# EAGLE schematic AttenuvertingVCA_Test (EAGLE 8.0.0)
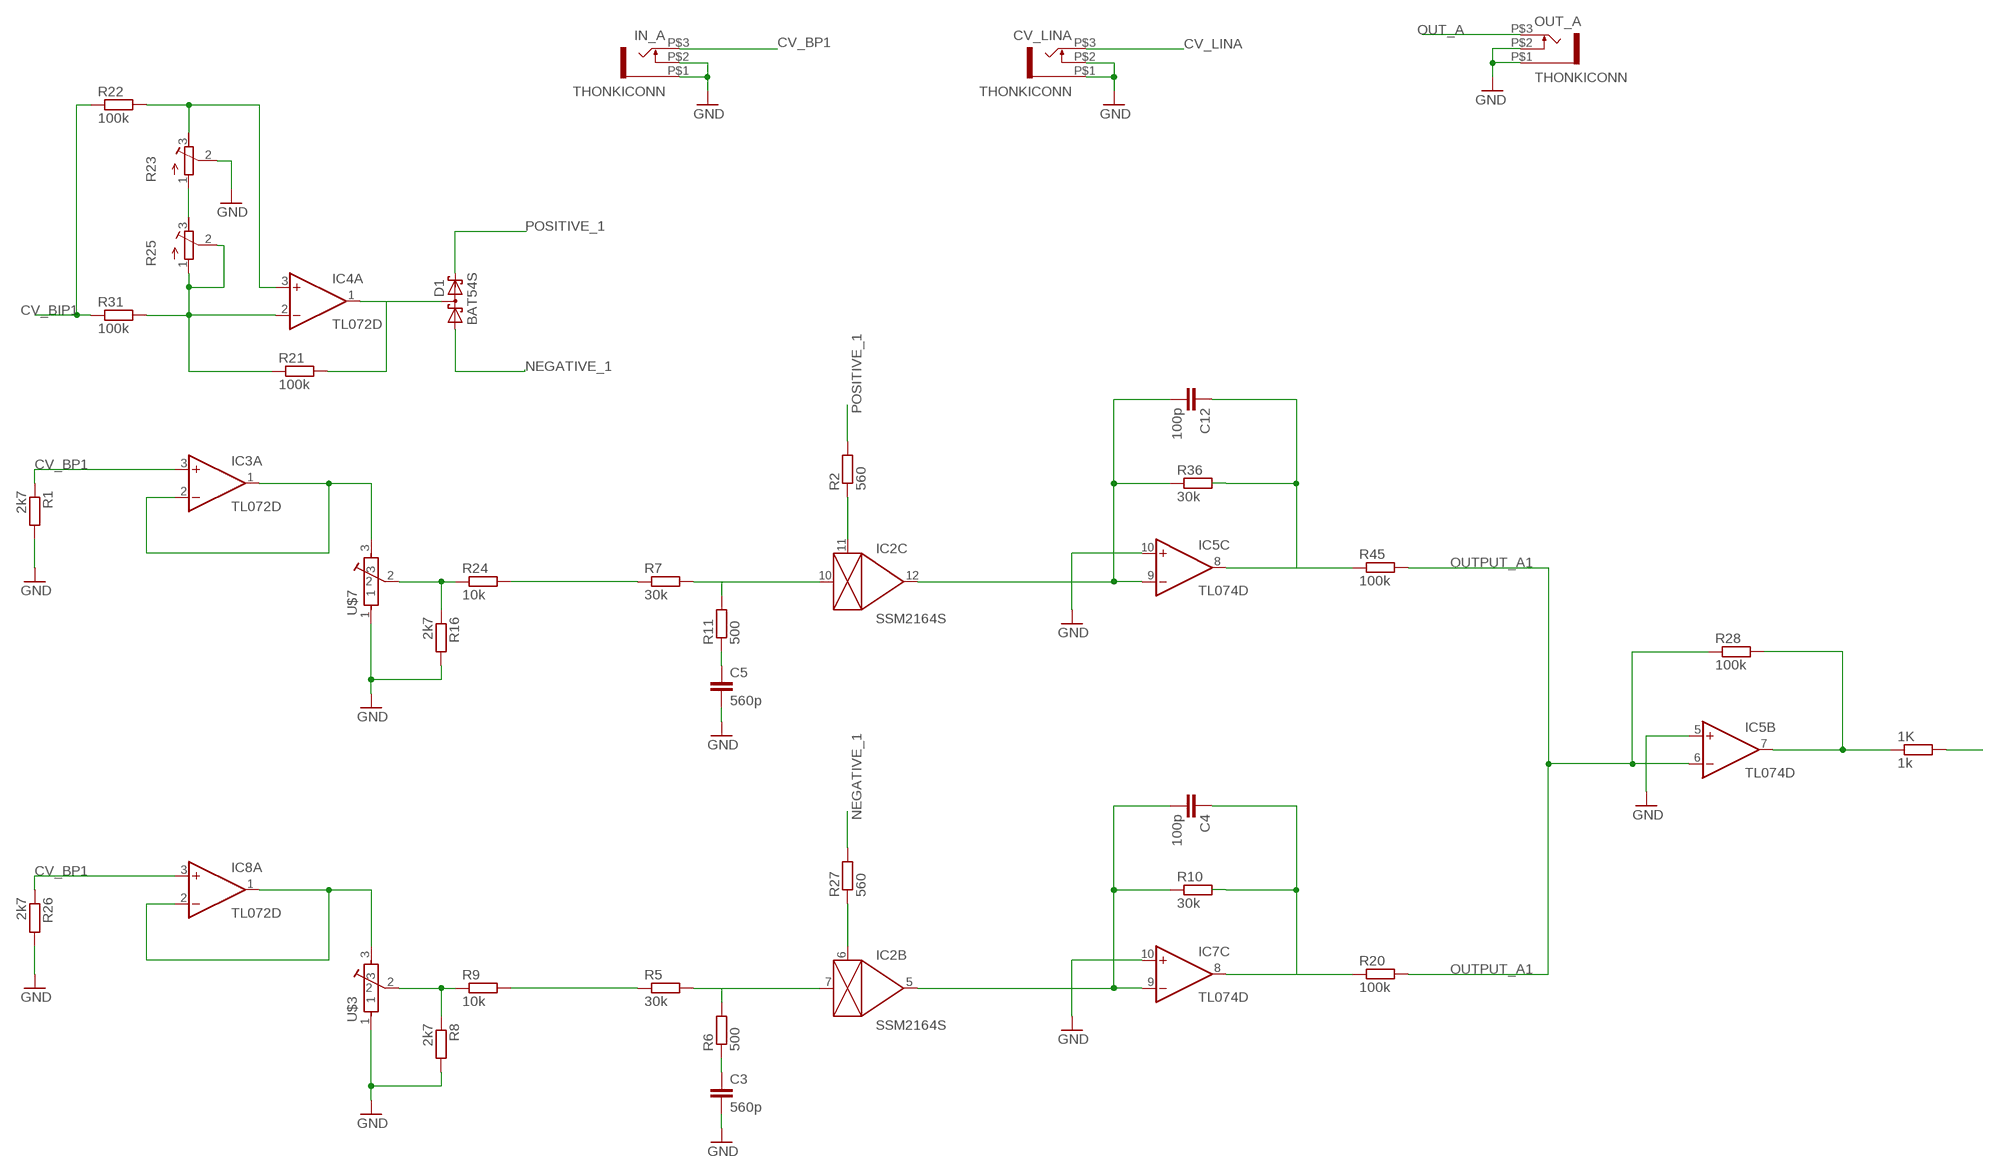
[diagram p0: schematic, sheet 1]

## Parts
1K  1k  R-EU_0603  [0603]
C3  560p  C-EUC0603K  [C0603K]
C4  100p  C-EUC0603K  [C0603K]
C5  560p  C-EUC0603K  [C0603K]
C12  100p  C-EUC0603K  [C0603K]
CV_LINA  THONKICONN  [THONKICONN]
D1  BAT54S  [SOT23]
IC2  SSM2164S  [SOIC16N]
IC3  TL072D  [SO08]
IC4  TL072D  [SO08]
IC5  TL074D  [SO14]
IC7  TL074D  [SO14]
IC8  TL072D  [SO08]
IN_A  THONKICONN  [THONKICONN]
OUT_A  THONKICONN  [THONKICONN]
R1  2k7  R-EU_0603  [0603]
R2  560  R-EU_0603  [0603]
R5  30k  R-EU_0603  [0603]
R6  500  R-EU_0603  [0603]
R7  30k  R-EU_0603  [0603]
R8  2k7  R-EU_0603  [0603]
R9  10k  R-EU_0603  [0603]
R10  30k  R-EU_0603  [0603]
R11  500  R-EU_0603  [0603]
R16  2k7  R-EU_0603  [0603]
R20  100k  R-EU_0603  [0603]
R21  100k  R-EU_0603  [0603]
R22  100k  R-EU_0603  [0603]
R23  R-TRIMM64X  [RTRIM64X]
R24  10k  R-EU_0603  [0603]
R25  R-TRIMM64X  [RTRIM64X]
R26  2k7  R-EU_0603  [0603]
R27  560  R-EU_0603  [0603]
R28  100k  R-EU_0603  [0603]
R31  100k  R-EU_0603  [0603]
R36  30k  R-EU_0603  [0603]
R45  100k  R-EU_0603  [0603]
U$3  POT-ALPS-RK09L1140  [POT-ALPS-RK09L1140]
U$7  POT-ALPS-RK09L1140  [POT-ALPS-RK09L1140]

## Nets
CV_BIP1: R22.1 R31.1
CV_BP1: IC3.3(A:+IN) IC8.3(A:+IN) IN_A.P$3 R1.1 R26.1
CV_LINA: CV_LINA.P$3
GND: C3.2 C5.2 CV_LINA.P$1 CV_LINA.P$2 IC5.5(B:+IN) IC5.10(C:+IN) IC7.10(C:+IN) IN_A.P$1 IN_A.P$2 OUT_A.P$1 OUT_A.P$2 R1.2 R8.2 R16.2 R23.2(S) R26.2 U$3.1 U$7.1
N$1: IC3.1(A:OUT) IC3.2(A:-IN) U$7.3
N$5: IC2.11(C:CTRL) R2.1
N$6: C3.1 R6.1
N$12: IC4.2(A:-IN) R21.1 R25.1(A) R25.2(S) R31.2
N$13: IC4.3(A:+IN) R22.2 R23.3(E)
N$14: R23.1(A) R25.3(E)
N$16: IC2.7(B:IN) R5.2 R6.2
N$17: R8.1 R9.1 U$3.2
N$18: R5.1 R9.2
N$19: C5.1 R11.1
N$20: C4.2 IC2.5(B:OUT) IC7.9(C:-IN) R10.1
N$21: C4.1 IC7.8(C:OUT) R10.2 R20.1
N$22: IC8.1(A:OUT) IC8.2(A:-IN) U$3.3
N$23: IC2.10(C:IN) R7.2 R11.2
N$24: IC2.6(B:CTRL) R27.1
N$25: 1K.1 IC5.7(B:OUT) R28.2
N$26: R7.1 R24.2
N$27: 1K.2
N$34: R16.1 R24.1 U$7.2
N$42: D1.3(C1A2) IC4.1(A:OUT) R21.2
N$49: C12.2 IC2.12(C:OUT) IC5.9(C:-IN) R36.1
N$51: C12.1 IC5.8(C:OUT) R36.2 R45.1
NEGATIVE_1: D1.1(A1) R27.2
OUT_A: OUT_A.P$3
OUTPUT_A1: IC5.6(B:-IN) R20.2 R28.1 R45.2
POSITIVE_1: D1.2(C2) R2.2
Unconnected: IC2.1(E:MODE) IC2.2(A:IN) IC2.3(A:CTRL) IC2.4(A:OUT) IC2.13(D:OUT) IC2.14(D:CTRL) IC2.15(D:IN) IC3.5(B:+IN) IC3.6(B:-IN) IC3.7(B:OUT) IC4.5(B:+IN) IC4.6(B:-IN) IC4.7(B:OUT) IC5.1(A:OUT) IC5.2(A:-IN) IC5.3(A:+IN) IC5.12(D:+IN) IC5.13(D:-IN) IC5.14(D:OUT) IC7.1(A:OUT) IC7.2(A:-IN) IC7.3(A:+IN) IC7.5(B:+IN) IC7.6(B:-IN) IC7.7(B:OUT) IC7.12(D:+IN) IC7.13(D:-IN) IC7.14(D:OUT) IC8.5(B:+IN) IC8.6(B:-IN) IC8.7(B:OUT) U$3.P$5 U$3.P$6 U$7.P$5 U$7.P$6

## Power pins joined to a net without a drawn wire
GND: IC2.8(E:GND)
V+: IC2.16(E:V+) IC3.8(P:V+) IC4.8(P:V+) IC5.4(P:V+) IC7.4(P:V+) IC8.8(P:V+)
V-: IC2.9(E:V-) IC3.4(P:V-) IC4.4(P:V-) IC5.11(P:V-) IC7.11(P:V-) IC8.4(P:V-)

## Library data of the parts
1K R1 R2 R5-R11 R16 R20-R22 R24 R26-R28 R31 R36 R45 = Rebel:R-EU_: RESISTOR, European symbol
C3-C5 C12 = resistor:C-EU: CAPACITOR, European symbol
CV_LINA IN_A OUT_A = Rebel:THONKICONN
D1 = diode:BAT54S: Schottky Diodes Pin connection corrected 2011-05-04 Source: Fairchild .. BAT54.pdf
IC2 = ssm2164:SSM2164
IC3 IC4 IC8 = linear:TL072: OP AMP
IC5 IC7 = linear:TL074: OP AMP
R23 R25 = resistor:R-TRIMM: Trimm resistor
U$3 U$7 = Rebel:POT-ALPS-RK09L